# Altium schematic sheet 3V3_Buck.SchDoc
size 259 x 167 mm; SheetNumber: 9; SheetTotal: 15
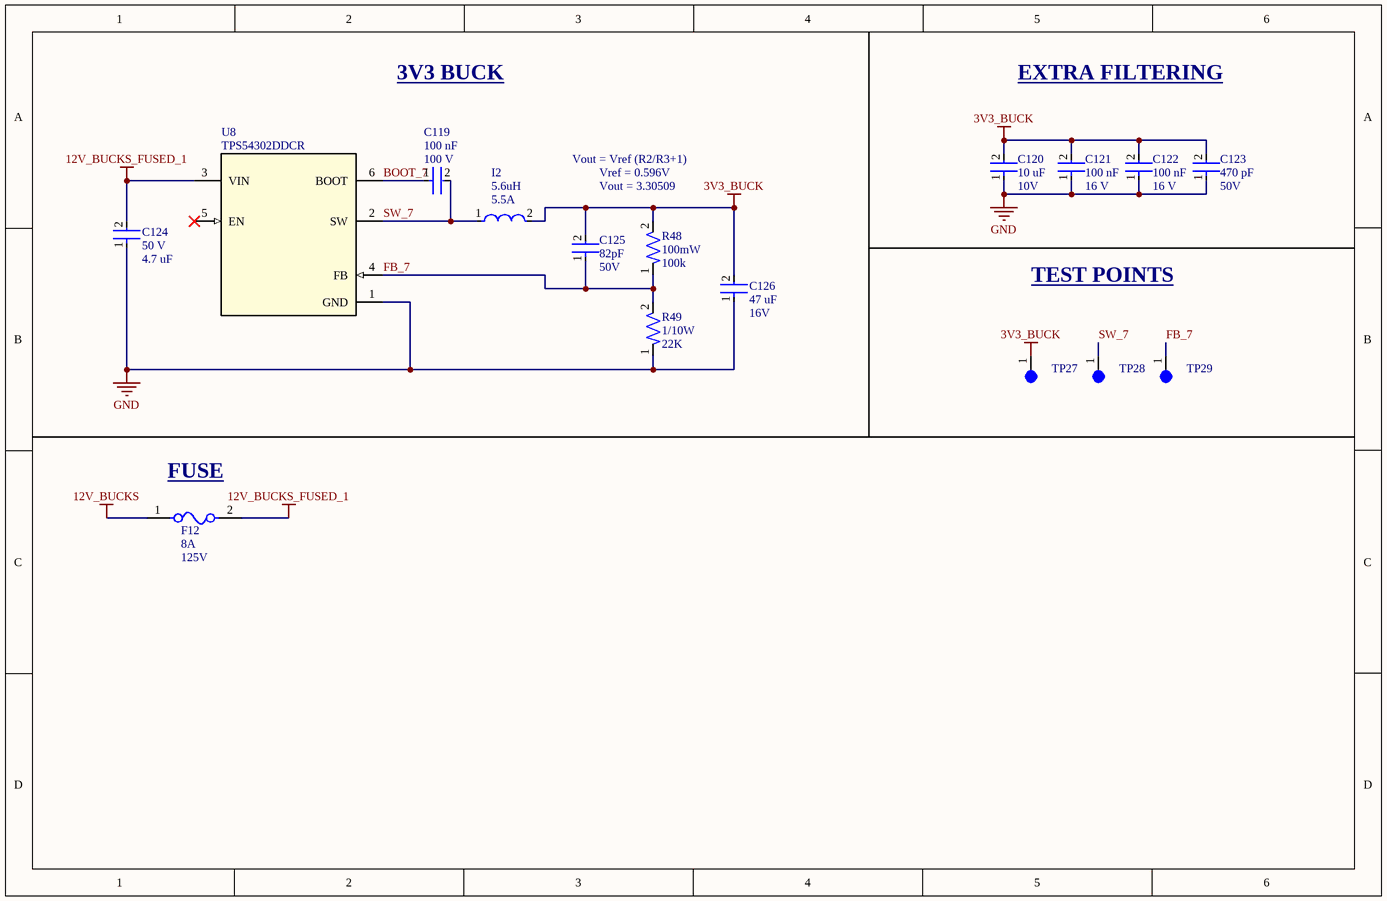
[diagram p0: 3V3_Buck.SchDoc]

## Parts
C119  Capacitance: 100 nF  Voltage: 100 V  [CAP-0603]  (hidden comment: CC0603KRX7R0BB104)
C120  Voltage: 10V  Capacitance: 10 uF  [CAP-0603]  (hidden comment: CC0603KRX5R6BB106)
C121  Voltage Rating: 16 V  Capacitance: 100 nF  [CAP-0402]  (hidden comment: CC0402KRX7R7BB104)
C122  Voltage Rating: 16 V  Capacitance: 100 nF  [CAP-0402]  (hidden comment: CC0402KRX7R7BB104)
C123  Voltage: 50V  Capacitance: 470 pF  [CAP-0805]  (hidden comment: CC0805JRNPO9BN471)
C124  Voltage: 50 V  Capacitance: 4.7 uF  [CAP-0805]  (hidden comment: CC0805KKX5R9BB475)
C125  Voltage: 50V  Capacitance: 82pF  [CAP-0805]  (hidden comment: CC0805JRNPO9BN820)
C126  Capacitance: 47 uF  Voltage: 16V  [CAP-1210]  (hidden comment: GRM32ER61C476KE15L)
F12  Fuse Current: 8A  Voltage Rating: 125V  [FUSE-0001]  (hidden comment: 01550900M)
I2  Saturation Current: 5.5A  Inductance: 5.6uH  [IND_SRP6540-5R6M]  (hidden comment: SRP6540-5R6M)
R48  Power: 100mW  Resistance: 100k  [RES-0603]  (hidden comment: RC0603FR-07100KL)
R49  Power: 1/10W  Resistance: 22K  [RES-0603]  (hidden comment: RC0603FR-0722KL)
TP27  5003  [TEST-POINT-0001]  (value not drawn)
TP28  5003  [TEST-POINT-0001]  (value not drawn)
TP29  5003  [TEST-POINT-0001]  (value not drawn)
U8  TPS54302DDCR  [IC-SOT-23-6]

## Nets
3V3_BUCK: C120.2 C121.2 C122.2 C123.2 C125.2 C126.2 I2.2 R48.2 TP27.1
12V_BUCKS: F12.1
12V_BUCKS_FUSED_1: C124.2 F12.2 U8.3(VIN)
GND: C120.1 C121.1 C122.1 C123.1 C124.1 C126.1 R49.1 U8.1(GND)
BOOT_7: C119.1 U8.6(BOOT)
FB_7: C125.1 R48.1 R49.2 TP29.1 U8.4(FB)
SW_7: C119.2 I2.1 TP28.1 U8.2(SW)

Not connected (* = marked no-connect by the designer): U8 5(EN)*

## Notes on the sheet
- 3V3 BUCK
- EXTRA FILTERING
- Vout = Vref (R2/R3+1)
- Vref = 0.596V
- Vout = 3.30509
- TEST POINTS
- (near F12) FUSE

## Library data of the parts
C119 = CAP-100N-0001: CAP CER 0.1UF 100V X7R 0603; Device Class: Ceramic; Size: 0603; ComponentLink1Description: Datasheet; ComponentLink1URL: https://www.yageo.com/upload/media/product/app/datasheet/mlcc/upy-np0x7r_mv_100-to-630v.pdf
C120 = CAP-10U-0001: CAP CER 10UF 10V X5R 0603; ComponentLink1Description: Datasheet; ComponentLink1URL: https://www.yageo.com/upload/media/product/app/datasheet/mlcc/upy-gphc_x5r_4v-to-50v.pdf; Device Class: Ceramic; Size: 0603
C121 C122 = CAP-0.1U-0001: CAP CER 0.1UF 16V X7R 0402; ComponentLink2Description: Datasheet; ComponentLink2URL: https://www.yageo.com/upload/media/product/productsearch/datasheet/mlcc/UPY-GPHC_X7R_6.3V-to-250V_24.pdf; Device Class: Ceramic; Size: 0402
C123 = CAP-470P-0001: CAP CER 470PF 50V C0G/NPO 0805; Device Class: Ceramic; Size: 0805; ComponentLink1Description: Datasheet; ComponentLink1URL: https://www.yageo.com/upload/media/product/productsearch/datasheet/mlcc/UPY-GP_NP0_16V-to-50V_18.pdf
C124 = CAP-4.7U-0002: CAP CER 4.7UF 50V X5R 0805; ComponentLink2Description: Datasheet; ComponentLink2URL: http://www.yageo.com/documents/recent/UPY-GPHC_Y5V_6.3V-to-50V_8.pdf; Device Class: Ceramic; Size: 0805
C125 = CAP-82P-0001: 82 pF ±5% 50V Ceramic Capacitor C0G, NP0 0805 (2012 Metric)
C126 = CAP-47U-0002: CAP CER 47UF 16V X5R 1210; Device Class: Ceramic; Size: 1210; ComponentLink1Description: Datasheet; ComponentLink1URL: https://search.murata.co.jp/Ceramy/image/img/A01X/G101/ENG/GRM32ER61C476KE15-01.pdf
F12 = FUSE-0001: FUSE BLOK CARTRIDGE 125V 10A SMD; ComponentLink2Description: Datasheet; ComponentLink2URL: https://www.littelfuse.com/~/media/electronics/datasheets/fuses/littelfuse_fuse_154_154t_154l_154tl_datasheet.pdf.pdf
I2 = IND-5.6U-0002: FIXED IND 5.6UH 5.5A 38 MOHM SMD
R48 = RES-100k-0001: RES SMD 100K OHM 1% 1/10W 0603; Tolerance: 1%; Size: 0603; ComponentLink1Description: Datasheet; ComponentLink1URL: https://www.yageo.com/upload/media/product/products/datasheet/rchip/PYu-RC_Group_51_RoHS_L_12.pdf
R49 = RES-22k-0001: 22 kOhms ±1% 0.1W, 1/10W Chip Resistor 0603 (1608 Metric) Moisture Resistant Thick Film; Parameter 1: *
TP27-TP29 = TEST-POINT-0001: Oranange PC Test Point, Miniature Phoisphor Bronze Silver Plating Through Hole Mounting Type
U8 = IC-BUCK-0004: IC REG BUCK ADJ 3A SOT23